# EAGLE design DSKYR1 (EAGLE 9.6.2)
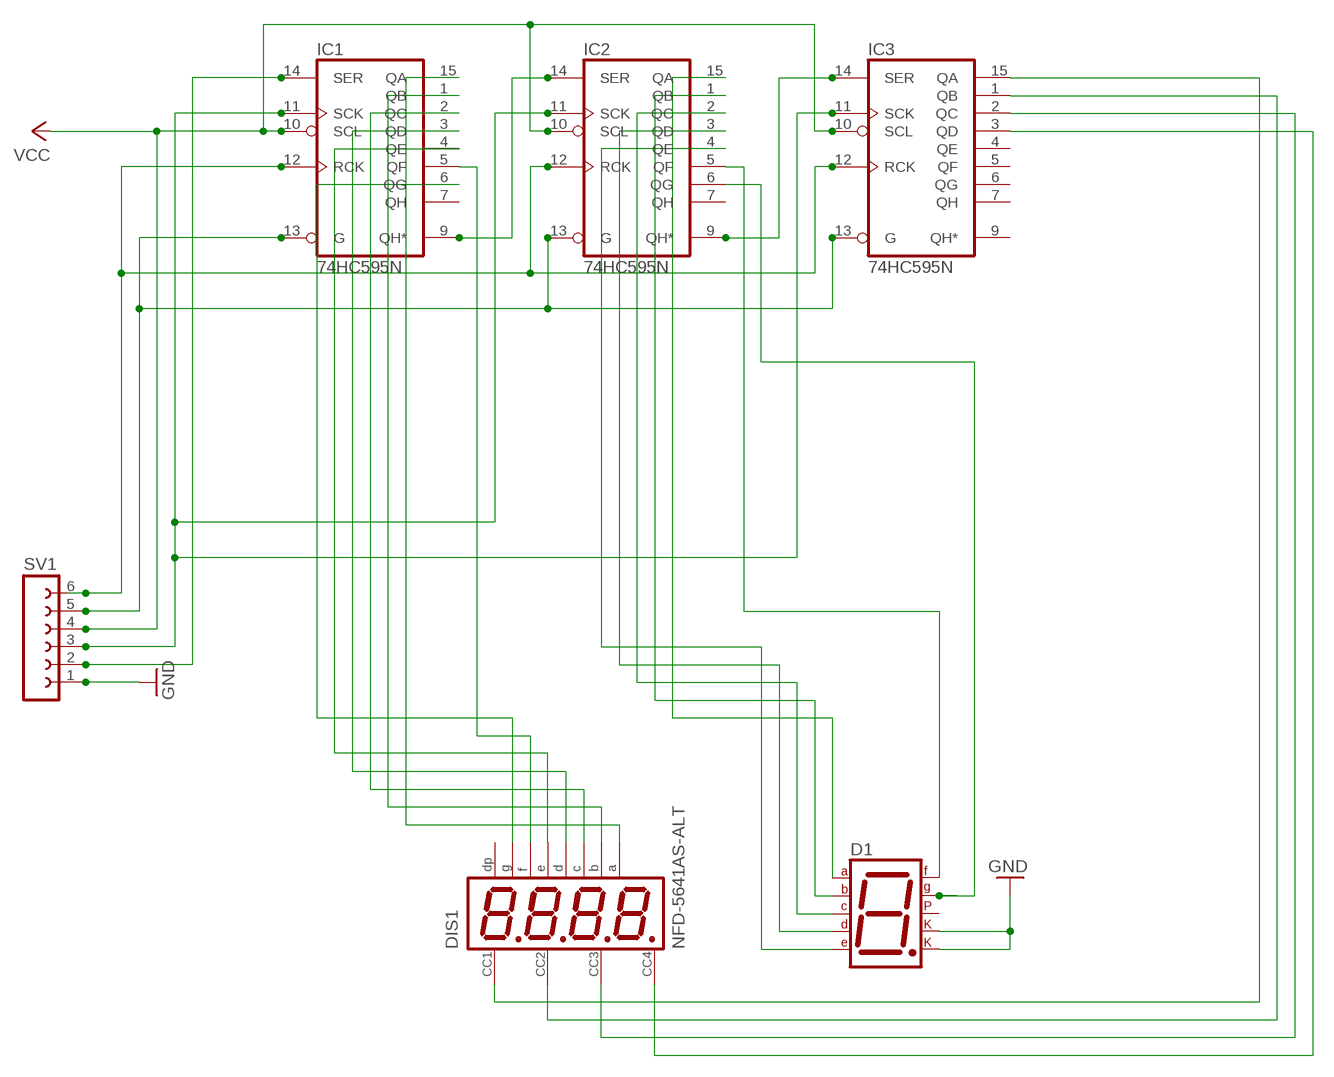
[diagram p0: schematic, sheet 1]

## Parts
D1  7SEG-CK  [7SEG-13]
DIS1  NFD-5641AS-ALT  [NFD-5641]
IC1  74HC595N  [DIL16]
IC2  74HC595N  [DIL16]
IC3  74HC595N  [DIL16]
SV1  FE06-1  [FE06]

## Nets
GND: D1.3(CK1) D1.8(CK2) SV1.1
N$1: IC1.12(RCK) IC2.12(RCK) IC3.12(RCK) SV1.6
N$2: DIS1.P$10 IC1.5(QF)
N$3: DIS1.P$5 IC1.6(QG)
N$4: IC1.13(G) IC2.13(G) IC3.13(G) SV1.5
N$6: IC1.14(SER) SV1.2
N$7: IC1.9(QH*) IC2.14(SER)
N$8: IC1.11(SCK) IC2.11(SCK) IC3.11(SCK) SV1.3
N$9: IC2.9(QH*) IC3.14(SER)
N$10: DIS1.P$11 IC1.15(QA)
N$11: DIS1.P$7 IC1.1(QB)
N$12: DIS1.P$4 IC1.2(QC)
N$13: DIS1.P$2 IC1.3(QD)
N$14: DIS1.P$1 IC1.4(QE)
N$15: D1.7(A) IC2.15(QA)
N$16: D1.6(B) IC2.1(QB)
N$17: D1.4(C) IC2.2(QC)
N$18: D1.2(D) IC2.3(QD)
N$19: D1.1(E) IC2.4(QE)
N$20: D1.9(F) IC2.5(QF)
N$21: D1.10(G) IC2.6(QG)
N$22: DIS1.P$12 IC3.15(QA)
N$23: DIS1.P$9 IC3.1(QB)
N$24: DIS1.P$8 IC3.2(QC)
N$25: DIS1.P$6 IC3.3(QD)
VCC: IC1.10(SCL) IC2.10(SCL) IC3.10(SCL) SV1.4
Unconnected: D1.5(DP) DIS1.P$3 IC1.7(QH) IC2.7(QH) IC3.4(QE) IC3.5(QF) IC3.6(QG) IC3.7(QH) IC3.9(QH*)

## Power pins joined to a net without a drawn wire
GND: IC1.8(GND) IC2.8(GND) IC3.8(GND)
VCC: IC1.16(VCC) IC2.16(VCC) IC3.16(VCC)

## Library data of the parts
D1 = special:7SEG-CK: 7-segment DISPLAY single cathode, 13 mm
DIS1 = display-nfd:NFD-5641AS-ALT: Four Digit 0.56" CC Seven-Segment LED Display Futurlec part number: 7FR5641AS Created by RobG
IC1-IC3 = 74xx-eu:74*595: 8-bit SHIFT REGISTER, output latch
SV1 = con-lsta:FE06-1: FEMALE HEADER; OC_FARNELL: unknown; OC_NEWARK: unknown

## Board
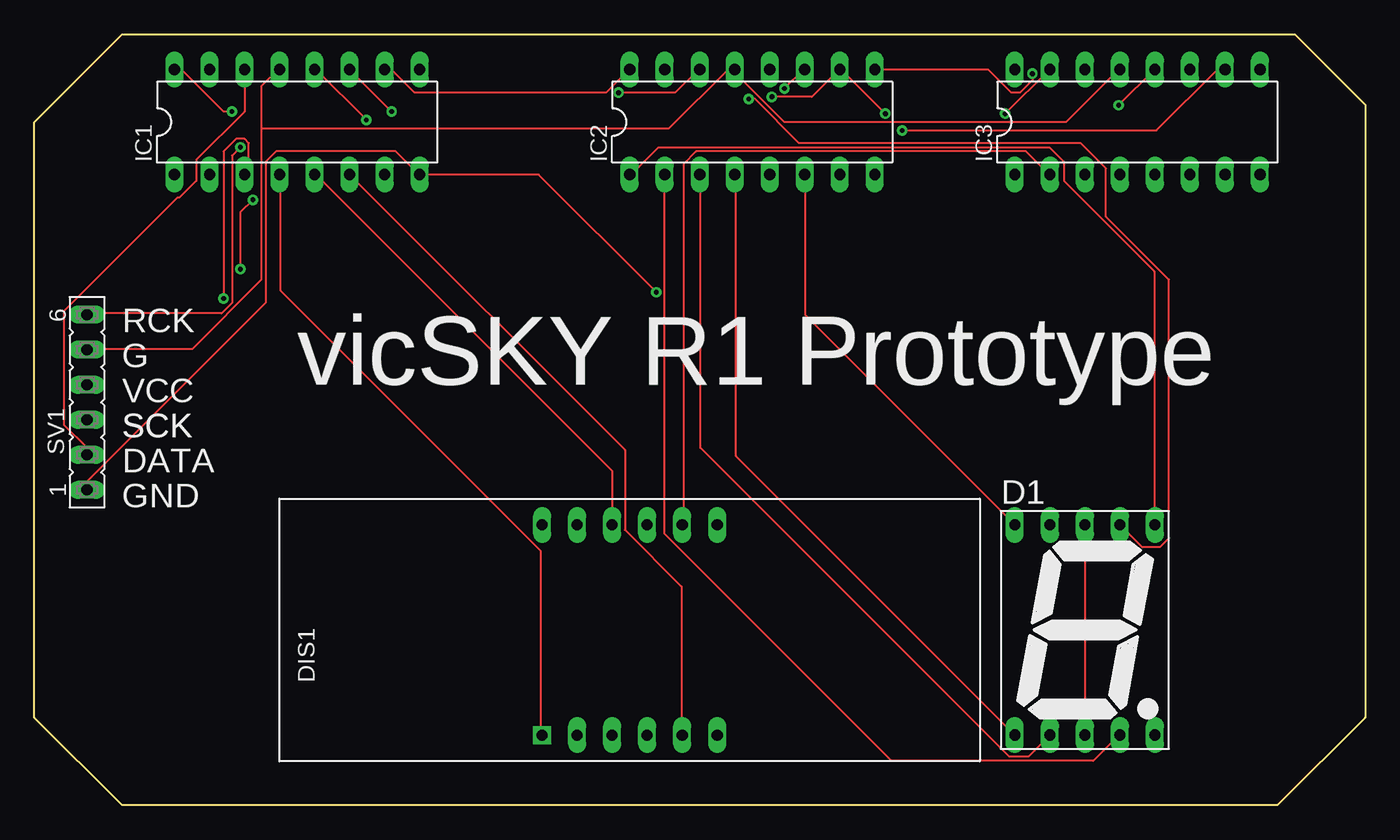
[diagram p1: board, top side]
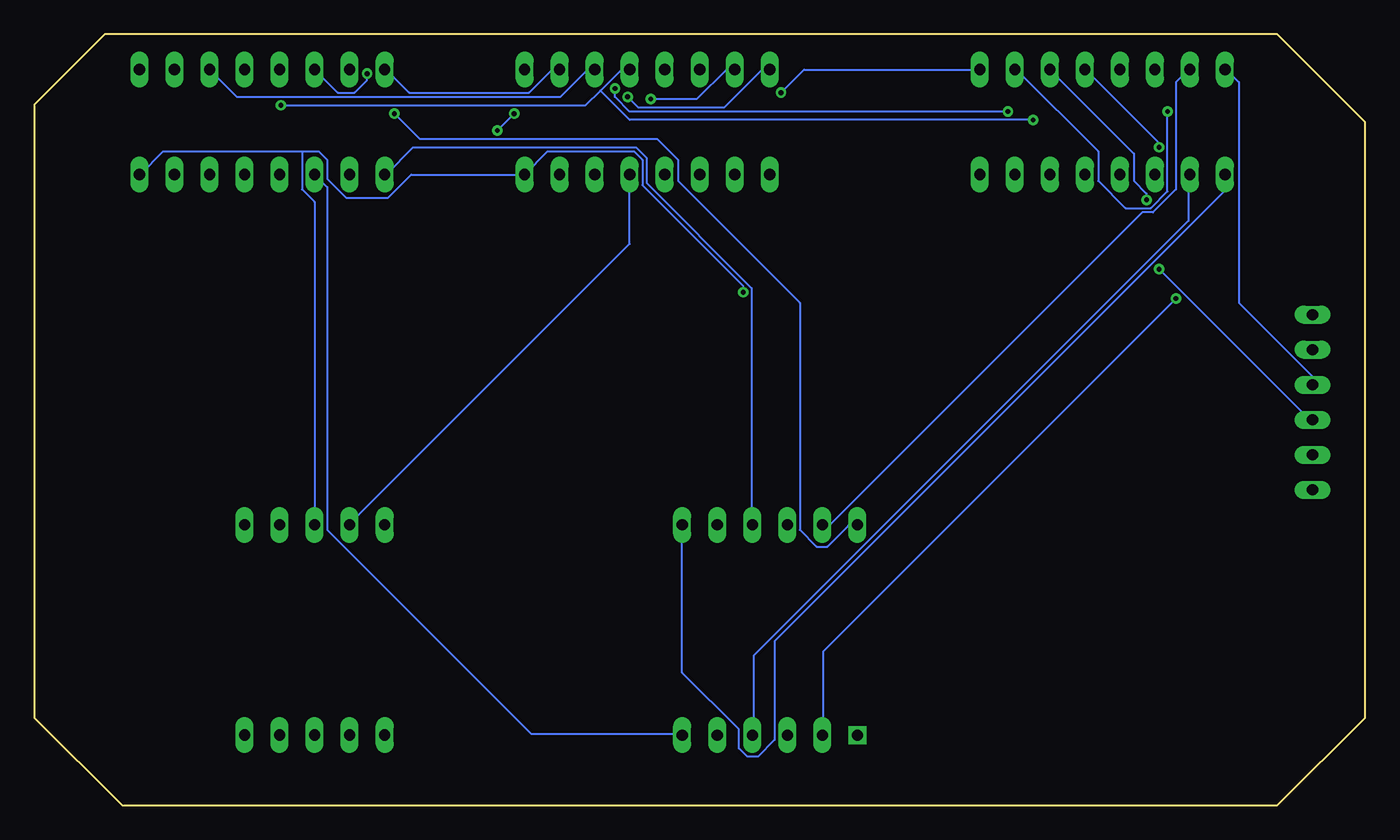
[diagram p2: board, bottom side, seen from below]

Size 96.52 x 55.88 mm. Coordinates in mm from the lower left corner, seen from the top.
Outline: 6.35,0 0,6.35 0,49.53 6.35,55.88 91.44,55.88 96.52,50.8 96.52,6.35 90.17,0 6.35,0
Copper layers (1*16): Top 0.035mm / dielectric 1.5mm / Bottom 0.035mm
Design rules "default": minimum track width 6mil, minimum drill 0.35mm, track to track 6mil, track to pad 6mil, pad to pad 6mil, via to via 6mil, smd to smd 6mil, copper to edge 40mil, drill to drill 6mil, minimum pad ring 10mil, minimum via ring 8mil, stop-mask expansion 4mil, vias tented up to drill 0mil, thermal gap 10mil

### Footprints (pad centres in the part's own frame; a part is rotated, then mirrored left to right if it is on the bottom)
7SEG-13 = drill 0.813 long: 1 -5.08,-7.62; 2 -2.54,-7.62; 3 0,-7.62; 4 2.54,-7.62; 5 5.08,-7.62; 6 5.08,7.62; 7 2.54,7.62; 8 0,7.62; 9 -2.54,7.62; 10 -5.08,7.62
NFD-5641 = drill 0.8 square: P$1 -6.35,-7.62 | drill 0.8 long: P$2 -3.81,-7.62; P$3 -1.27,-7.62; P$4 1.27,-7.62; P$5 3.81,-7.62; P$6 6.35,-7.62; P$7 6.35,7.62; P$8 3.81,7.62; P$9 1.27,7.62; P$10 -1.27,7.62; P$11 -3.81,7.62; P$12 -6.35,7.62
DIL16 = drill 0.813 long: 1 -8.89,-3.81; 2 -6.35,-3.81; 3 -3.81,-3.81; 4 -1.27,-3.81; 5 1.27,-3.81; 6 3.81,-3.81; 7 6.35,-3.81; 8 8.89,-3.81; 9 8.89,3.81; 10 6.35,3.81; 11 3.81,3.81; 12 1.27,3.81; 13 -1.27,3.81; 14 -3.81,3.81; 15 -6.35,3.81; 16 -8.89,3.81
FE06 = drill 0.813 long: 1 -6.35,0; 2 -3.81,0; 3 -1.27,0; 4 1.27,0; 5 3.81,0; 6 6.35,0

### Placement (x,y rotation side)
D1  76.2,12.7 0 top
DIS1  43.18,12.7 0 top
IC1  19.05,49.53 0 top
IC2  52.07,49.53 0 top
IC3  80.01,49.53 0 top
SV1  3.81,29.21 90 top

### Tracks (layer width: path | path; a pad name or v marks a point on that pad's centre or on a via)
GND  (via drill 0.35)
  Top 0.152: SV1.1 3.81,23.47 16.76,36.42 16.76,46.63 17.53,47.4 26.21,47.4 27.89,45.72 IC1.8 36.58,45.72 v45.11,37.19 | D1.8 D1.3
  Bottom 0.152: 77.11,47.4 87.17,47.4 88.85,45.72 IC3.8 | 77.11,47.4 75.89,47.4 75.29,46.79 75.29,45.41 73.91,44.04 70.87,44.04 69.19,45.72 IC2.8 59.28,47.4 53.03,47.4 52.43,46.79 52.43,44.96 45.11,37.64 v45.11,37.19 | D1.8 76.2,43.74 77.11,44.65 77.11,47.4
N$1  (via drill 0.35)
  Top 0.152: v78.64,50.75 81.23,53.34 IC3.12 | v14.94,47.7 14.33,47.09 14.33,36.42 13.56,35.66 3.81,35.66 SV1.6 | v24.08,49.68 20.42,53.34 IC1.12
  Bottom 0.152: IC2.12 53.95,53.34 55.47,51.82 | 55.47,51.82 56.54,50.75 v78.64,50.75 | v14.94,47.7 14.94,48.01 20.27,53.34 IC1.12 | 55.47,51.82 53.34,49.68 v24.08,49.68
N$2
  Top 0.152: DIS1.P$10 41.91,24.23 20.42,45.72 IC1.5
N$3
  Top 0.152: IC1.6 42.82,25.76 42.82,19.96 46.94,15.85 46.94,5.18 DIS1.P$5
N$4
  Top 0.152: IC3.13 78.64,53.34 74.83,49.53 54.41,49.53 50.9,53.04 50.9,53.34 IC2.13 50.29,53.34 46.02,49.07 16.46,49.07 | 16.46,49.07 16.46,52.12 17.68,53.34 IC1.13 | 16.46,49.07 16.46,38.1 11.43,33.07 3.81,33.07 SV1.5
N$6
  Top 0.152: SV1.2 3.81,25.91 2.13,27.58 2.13,35.81 10.36,44.04 10.52,44.04 11.73,45.26 11.73,46.79 15.24,50.29 IC1.14
N$7  (via drill 0.35)
  Top 0.152: v42.37,51.66 46.48,51.66 48.16,53.34 IC2.14
  Bottom 0.152: IC1.9 40.69,53.34 v42.37,51.66
N$8  (via drill 0.35)
  Top 0.152: v14.94,38.86 14.94,42.98 v15.85,43.89 | v54.41,51.97 55.78,53.34 IC2.11 | IC1.11 v25.91,50.29
  Bottom 0.152: IC2.11 56.39,53.34 58.37,51.36 81.84,51.36 IC3.11 | v14.94,38.86 4.12,28.04 3.81,28.04 SV1.3 | v15.85,43.89 15.85,44.35 16.76,45.26 16.76,47.24 IC1.11 | v54.41,51.97 54.41,51.36 53.34,50.29 v25.91,50.29
N$9  (via drill 0.35)
  Top 0.152: IC2.9 69.19,53.34 70.87,51.66 71.48,51.66 72.39,52.58 v72.39,53.04
  Bottom 0.152: v72.39,53.04 72.39,52.58 73.3,51.66 74.52,51.66 IC3.14
N$10
  Bottom 0.152: DIS1.P$11 39.32,20.42 38.71,20.42 16.15,42.98 15.39,42.98 13.72,44.65 13.72,52.43 12.8,53.34 IC1.15
N$11
  Bottom 0.152: DIS1.P$7 49.53,9.6 45.41,5.49 45.41,4.12 44.81,3.5 44.04,3.5 42.82,4.72 42.82,11.89 10.21,44.5 10.21,45.72 IC1.1
N$12
  Bottom 0.152: DIS1.P$4 44.35,5.18 44.35,10.82 12.8,42.37 12.8,45.72 IC1.2
N$13  (via drill 0.35)
  Top 0.152: v13.72,36.73 13.72,47.4 14.63,48.31 15.24,48.31 15.54,48.01 15.54,46.02 IC1.3
  Bottom 0.152: v13.72,36.73 39.32,11.12 39.32,5.18 DIS1.P$2
N$14
  Top 0.152: DIS1.P$1 36.73,5.18 36.73,18.44 17.83,37.34 17.83,45.72 IC1.4
N$15  (via drill 0.35)
  Top 0.152: v51.82,51.21 52.27,51.21 55.47,48.01 75.89,48.01 77.72,46.18 77.72,42.67 82.3,38.1 82.3,19.35 81.69,18.74 80.31,18.74 D1.7
  Bottom 0.152: IC2.15 46.33,53.34 48.46,51.21 v51.82,51.21
N$16
  Top 0.152: D1.6 81.23,20.42 81.23,38.71 74.68,45.26 74.68,46.63 73.61,47.7 45.26,47.7 43.28,45.72 IC2.1
N$17
  Top 0.152: IC2.2 45.72,19.66 62.18,3.2 76.81,3.2 78.64,5.03 D1.4
N$18
  Top 0.152: D1.2 72.08,3.5 70.71,3.5 48.31,25.91 48.31,45.72 IC2.3
N$19
  Top 0.152: D1.1 50.9,25.3 50.9,45.72 IC2.4
N$20
  Bottom 0.152: IC2.5 53.34,40.69 73.61,20.42 D1.9
N$21
  Top 0.152: D1.10 55.93,35.51 55.93,45.72 IC2.6
N$22  (via drill 0.35)
  Top 0.152: v70.41,50.14 73.61,53.34 IC3.15
  Bottom 0.152: v70.41,50.14 68.58,48.31 51.36,48.31 49.84,46.79 49.84,45.26 41,36.42 41,19.96 39.78,18.74 39.01,18.74 37.49,20.27 36.88,20.27 DIS1.P$12
N$23
  Bottom 0.152: DIS1.P$9 44.5,20.42 44.5,37.49 52.12,45.11 52.12,46.94 52.88,47.7 69.04,47.7 71.02,45.72 IC3.1
N$24
  Top 0.152: DIS1.P$8 47.09,20.42 47.09,46.48 48.01,47.4 71.93,47.4 73.61,45.72 IC3.2
N$25
  Bottom 0.152: IC3.3 75.29,44.81 75.29,19.96 60.5,5.18 49.53,5.18 DIS1.P$6
VCC  (via drill 0.35)
  Top 0.152: IC1.10 25.91,53.34 27.58,51.66 41.45,51.66 43.13,53.34 IC2.16 | IC3.10 85.8,53.34 81.38,48.92 v62.94,48.92 | v61.72,50.14 58.52,53.34 IC2.10 58.37,53.34 56.39,51.36 v53.49,51.36 | IC1.16 10.67,53.34 13.72,50.29 v14.33,50.29
  Bottom 0.152: SV1.4 3.81,31.09 9.14,36.42 9.14,52.43 10.06,53.34 IC1.16 | IC2.10 58.98,53.34 60.66,51.66 69.34,51.66 71.02,53.34 IC3.16 | v61.72,50.14 v62.94,48.92 | IC2.16 43.74,53.34 46.48,50.6 52.73,50.6 v53.49,51.36 | v14.33,50.29 14.33,44.5 15.54,43.28 17.37,43.28 19.36,45.26 19.36,47.4 25.3,53.34 IC1.10

### Text on the board
tPlace: RCK | G | vicSKY R1 Prototype | VCC | SCK | SCK | DATA | GND